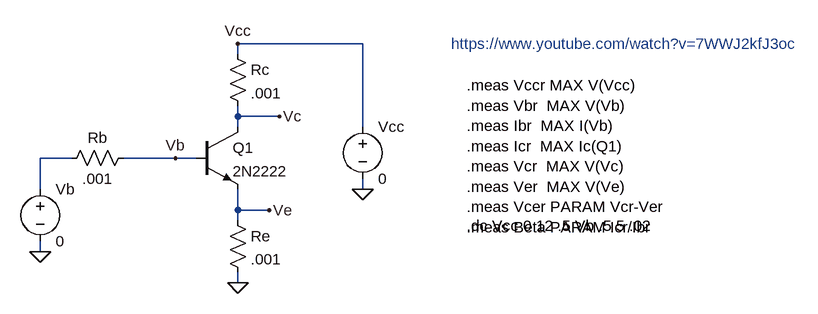
[diagram p0: schematic 2N2222 Beta Measurement Testing.asc]
2N2222 Beta Measurement Testing.asc, the LTspice schematic file:
Version 4
SHEET 1 1232 680
WIRE 448 16 256 16
WIRE 256 32 256 16
WIRE 256 128 256 112
WIRE 320 128 256 128
WIRE 256 144 256 128
WIRE 448 144 448 16
WIRE 0 192 -48 192
WIRE 160 192 80 192
WIRE 192 192 160 192
WIRE -48 240 -48 192
WIRE 448 240 448 224
WIRE 256 272 256 240
WIRE 304 272 256 272
WIRE 256 288 256 272
WIRE -48 336 -48 320
WIRE 256 384 256 368
FLAG 256 384 0
FLAG 448 240 0
FLAG -48 336 0
FLAG 320 128 Vc
FLAG 160 192 Vb
FLAG 304 272 Ve
FLAG 256 16 Vcc
SYMBOL npn 192 144 R0
SYMATTR InstName Q1
SYMATTR Value 2N2222
SYMBOL voltage 448 128 R0
WINDOW 123 0 0 Left 2
WINDOW 39 0 0 Left 2
SYMATTR InstName Vcc
SYMATTR Value 0
SYMBOL res 240 16 R0
SYMATTR InstName Rc
SYMATTR Value .001
SYMBOL voltage -48 224 R0
WINDOW 123 0 0 Left 2
WINDOW 39 0 0 Left 2
SYMATTR InstName Vb
SYMATTR Value 0
SYMBOL res 240 272 R0
SYMATTR InstName Re
SYMATTR Value .001
SYMBOL res 96 176 R90
WINDOW 0 0 56 VBottom 2
WINDOW 3 32 56 VTop 2
SYMATTR InstName Rb
SYMATTR Value .001
TEXT 608 296 Left 2 !.dc Vcc 0 12 .5 Vb .5 5 .02
TEXT 584 16 Left 2 ;https://www.youtube.com/watch?v=7WWJ2kfJ3oc
TEXT 608 80 Left 2 !.meas Vccr MAX V(Vcc)\n.meas Vbr  MAX V(Vb)\n.meas Ibr  MAX I(Vb)\n.meas Icr  MAX Ic(Q1)\n.meas Vcr  MAX V(Vc)\n.meas Ver  MAX V(Ve)\n.meas Vcer PARAM Vcr-Ver\n.meas Beta PARAM Icr/Ibr

The netlist it stands for:
* 2N2222 Beta Measurement Testing.asc
Q1 Vc Vb Ve 0 2N2222
Vcc Vcc 0 0
Rc Vcc Vc .001
Vb N001 0 0
Re Ve 0 .001
Rb Vb N001 .001
.model NPN NPN
.model PNP PNP
.lib standard.bjt
.dc Vcc 0 12 .5 Vb .5 5 .02
* https://www.youtube.com/watch?v=7WWJ2kfJ3oc
.meas Vccr MAX V(Vcc)
.meas Vbr  MAX V(Vb)
.meas Ibr  MAX I(Vb)
.meas Icr  MAX Ic(Q1)
.meas Vcr  MAX V(Vc)
.meas Ver  MAX V(Ve)
.meas Vcer PARAM Vcr-Ver
.meas Beta PARAM Icr/Ibr
.backanno
.end